# Altium schematic sheet Vertap_MCU.SchDoc: MCU
size 381 x 241 mm; Author: Taim Al-Dabbagh; DrawnBy: Taim Al-Dabbagh; Revision: v1; SheetNumber: 4; SheetTotal: 6
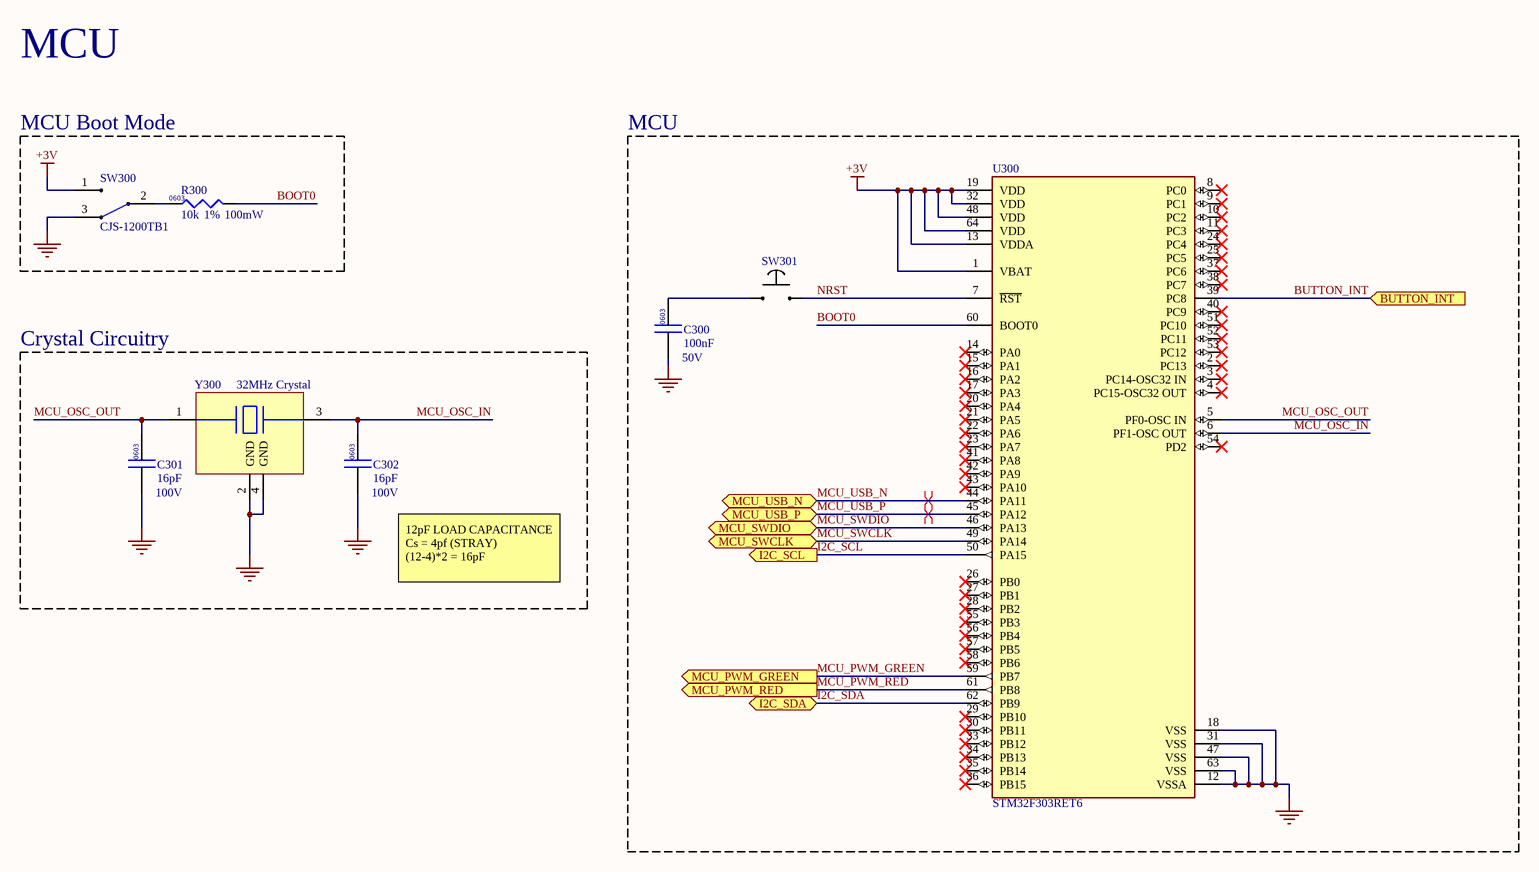
[diagram p0: Vertap_MCU.SchDoc]

## Parts
C300  100nF  [CAP_0603_MURATA]
C301  16pF  [CAP_0603_MURATA]
C302  16pF  [CAP_0603_MURATA]
R300  10k  [RES_0603_YAGEO]
SW300  CJS-1200TB1  [CJS-1200TB1]
SW301  LS38G2F-T  [LS38G2F-T]  (value not drawn)
U300  STM32F303RET6  [FP-LQFP64-5W-MFG]
Y300  32MHz Crystal  [CX2016SA32000H0FLJG1]

## Blocks framed on the sheet
MCU Boot Mode: R300 SW300
MCU: C300 SW301 U300
Crystal Circuitry: C301 C302 Y300

## Ports
BUTTON_INT (in), I2C_SCL (out), I2C_SDA (bidir), MCU_PWM_GREEN (out), MCU_PWM_RED (out), MCU_SWCLK (bidir), MCU_SWDIO (bidir), MCU_USB_N (bidir), MCU_USB_P (bidir)

## Nets
+3V: SW300.1 U300.1(VBAT) U300.13(VDDA) U300.19(VDD) U300.32(VDD) U300.48(VDD) U300.64(VDD)
GND: C300.2 C301.2 C302.2 SW300.3 U300.12(VSSA) U300.18(VSS) U300.31(VSS) U300.47(VSS) U300.63(VSS) Y300.2(GND) Y300.4(GND)
BOOT0: R300.2 U300.60(BOOT0)
BUTTON_INT: U300.39(PC8) ; port BUTTON_INT
I2C_SCL: U300.50(PA15) ; port I2C_SCL
I2C_SDA: U300.62(PB9) ; port I2C_SDA
MCU_OSC_IN: C302.1 U300.6(PF1-OSC_OUT) Y300.3(OUT)
MCU_OSC_OUT: C301.1 U300.5(PF0-OSC_IN) Y300.1(IN)
MCU_PWM_GREEN: U300.59(PB7) ; port MCU_PWM_GREEN
MCU_PWM_RED: U300.61(PB8) ; port MCU_PWM_RED
MCU_SWCLK: U300.49(PA14) ; port MCU_SWCLK
MCU_SWDIO: U300.46(PA13) ; port MCU_SWDIO
MCU_USB_N: U300.44(PA11) ; port MCU_USB_N
MCU_USB_P: U300.45(PA12) ; port MCU_USB_P
NRST: SW301.2 U300.7(~{RST})
NetC300_1: C300.1 SW301.1
NetR300_1: R300.1 SW300.2

Not connected (* = marked no-connect by the designer): U300 2(PC13)* 3(PC14-OSC32_IN)* 4(PC15-OSC32_OUT)* 8(PC0)* 9(PC1)* 10(PC2)* 11(PC3)* 14(PA0)* 15(PA1)* 16(PA2)* 17(PA3)* 20(PA4)* 21(PA5)* 22(PA6)* 23(PA7)* 24(PC4)* 25(PC5)* 26(PB0)* 27(PB1)* 28(PB2)* 29(PB10)* 30(PB11)* 33(PB12)* 34(PB13)* 35(PB14)* 36(PB15)* 37(PC6)* 38(PC7)* 40(PC9)* 41(PA8)* 42(PA9)* 43(PA10)* 51(PC10)* 52(PC11)* 53(PC12)* 54(PD2)* 55(PB3)* 56(PB4)* 57(PB5)* 58(PB6)*

## Layout directives
differential pair; differential pair class USB: MCU_USB_N, MCU_USB_P

## Notes on the sheet
- MCU
- (near R300) 0603
- (near R300) 1%
- (near R300) 100mW
- (near C300) 0603
- (near C300) 50V
- (near C301) 0603
- 100V
- (near C302) 0603
- (near C302) 100V
- 12pF LOAD CAPACITANCE
  Cs = 4pf (STRAY)
  (12-4)*2 = 16pF

## Library data of the parts
C300 = CAP_0.1uF_0603: CAP CER 0.1UF 50V X7R 0603; Supplier 1: Mouser; Supplier Part Number 1: 81-GCM188R71H104JA7D
C301 C302 = CAP_16pF_0603: CAP CER 16PF 100V C0G/NP0 0603; Supplier 1: Arrow Electronics
R300 = RES_0603_10K: RES 10K OHM 1% 1/10W 0603; Manufacturer: YAGEO; Manufacturer Part Number: AC0603FR-1310KL; Supplier 1: Arrow Electronics
SW300 = CJS-1200TB1: SWITCH SLIDE SPDT 100MA 6V; Supplier 1: Avnet; Supplier Part Number 1: CJS-1200TB1
SW301 = LS38G2F-T: TOP-PRESS TACTILE SWITCH; Supplier 1: Digi-Key; Supplier Part Number 1: 1642-LS38G2F-TCT-ND
U300 = CMP-0537-00048-2: IC MCU 32BIT 512KB FLASH 64LQFP; Manufacturer: STMicroelectronics; Data Bus Width: 32bits; Standoff Height: 0.05mm; Number Of Pwm Channels: 31; Number Of Timers/Counters: 6; Min Supply Voltage: 2V; Number Of Spi Channels: 4; Core Architecture: ARM Cortex-M4; Number Of I2C Channels: 3; Number Of Usb Channels: 1; Max Supply Voltage: 3.6V; Interface: I2C,SPI,UART,USART,CAN,USB,LIN,IrDA,I2S; Frequency: 72MHz; Max Junction Temp: +105°C; Number Of Uart Channels: 2; Number Of I/Os: 26; Memory Size: 512KBytes; Number Of Adc Channels: 22; Ram Size: 80KBytes; Nominal Supply Current: 4.27-66.4mA; ComponentLink2URL: https://www.st.com/resource/en/datasheet/stm32f303re.pdf; Automotive: No; Mouser Description: MCU 32-Bit STM32 ARM Cortex M4 RISC 512KB Flash 2.5V/3.3V 64-Pin LQFP Tray; Memory Type: FLASH; Temperature: -40°C to +105°C; Temperature Range Low: -40°C; Manufacturer Part Number: STM32F303RET6; Number Of A/D Converters: 4; Ambient Temperature Range High: +85°C; RoHS: TRUE; Category: IC; Ambient Temperature Range Low: -40°C; Number Of Cores: 1; Octopart: https://octopart.com/stm32f303ret6-stmicroelectronics-53115257; Height: 1.6mm; Device Class L2: Embedded Processors and Controllers; Device Class L3: Microcontrollers; Temperature Range High: +105°C; ComponentLink2Description: Datasheet; Lead Free: Yes; Digikey Description: IC MCU 32BIT 512KB FLASH 64LQFP; Package: LQFP64-5W; Device Class L1: Integrated Circuits (ICs)
Y300 = CX2016SA32000H0FLJG1: 32 MHz ±10ppm Crystal 12pF 60 Ohms 4-SMD, No Lead; Supplier 1: Digi-Key; Supplier Part Number 1: 478-CX2016SA32000H0FLJG1CT-ND